# Altium schematic sheet Test.SchDoc
size A
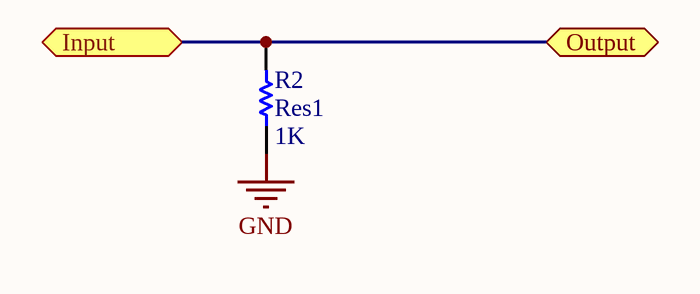
[diagram p0: Test.SchDoc]

## Parts
R2  Res1  value 1K  [AXIAL-0.3]

## Ports
Input (bidir), Output (bidir)

## Nets
GND: R2.1
Input: R2.2 ; port Input, port Output

## Library data of the parts
R2 = Res1: Resistor; Published: 8-Jun-2000; LatestRevisionDate: 17-Jul-2002; LatestRevisionNote: Re-released for DXP Platform.; PackageReference: AXIAL-0.3; Publisher: Altium Limited; PackageDescription: Axial Device, Thru-Hole; 2 Leads; 0.3 in Pin Spacing